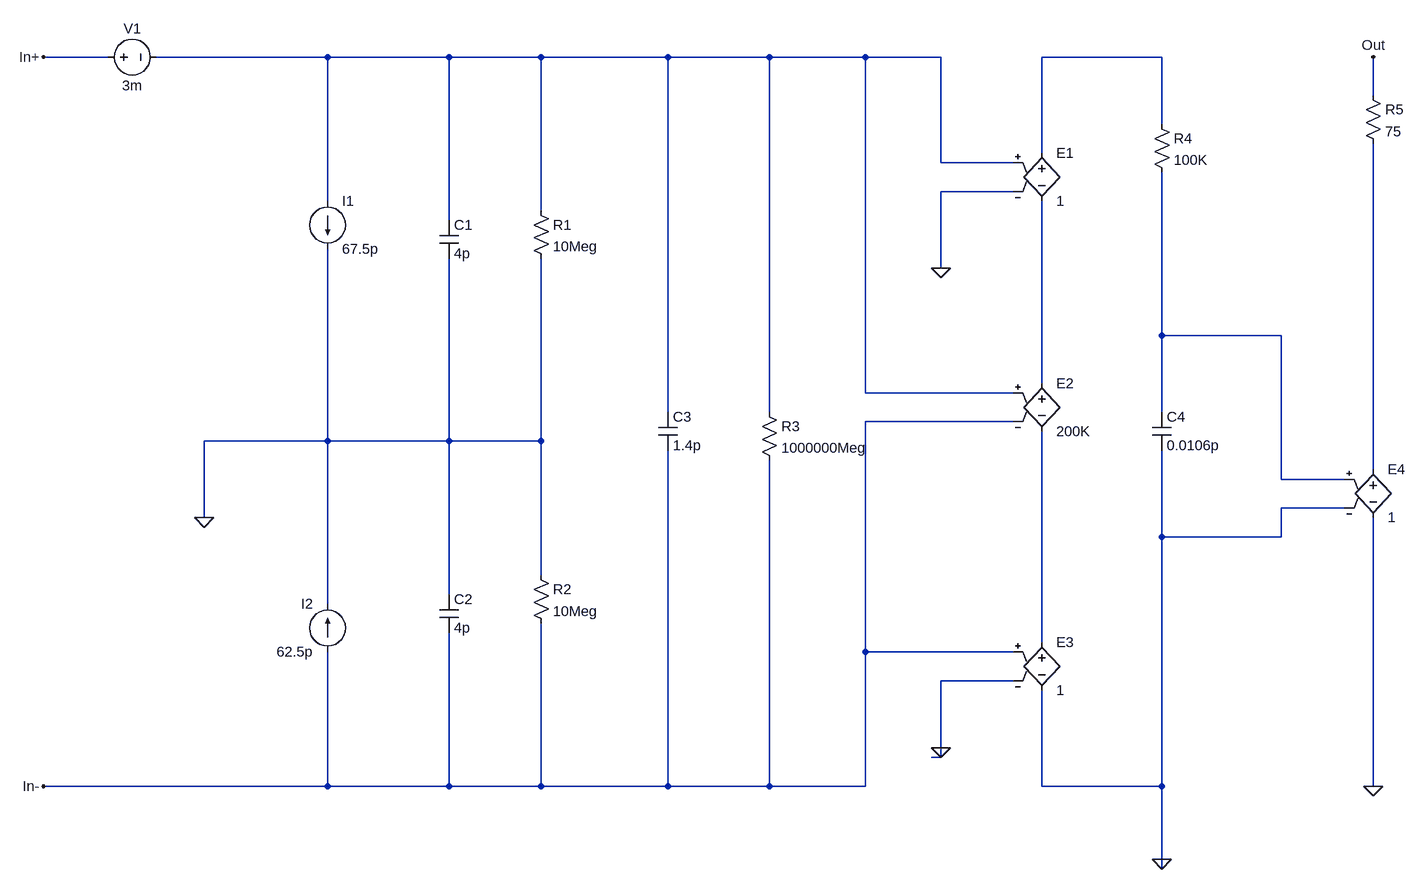
[diagram p0: schematic TL074_macromodel.asc]
TL074_macromodel.asc, the LTspice schematic file:
Version 4
SHEET 1 1640 1156
WIRE -1840 -272 -1968 -272
WIRE -1456 -272 -1760 -272
WIRE -1040 -272 -1456 -272
WIRE -640 -272 -1040 -272
WIRE -320 -272 -640 -272
WIRE -16 -272 -320 -272
WIRE 144 -272 -16 -272
WIRE 368 -272 144 -272
WIRE 960 -272 560 -272
WIRE 1584 -208 1584 -272
WIRE 960 -160 960 -272
WIRE 560 -112 560 -272
WIRE 368 -96 368 -272
WIRE 512 -96 368 -96
WIRE 512 -48 368 -48
WIRE -1456 -32 -1456 -272
WIRE -640 -16 -640 -272
WIRE -1040 0 -1040 -272
WIRE 368 80 368 -48
WIRE 368 80 352 80
WIRE 960 192 960 -80
WIRE 1424 192 960 192
WIRE 560 272 560 -32
WIRE 144 288 144 -272
WIRE 512 288 144 288
WIRE -320 320 -320 -272
WIRE -16 320 -16 -272
WIRE 960 320 960 192
WIRE 512 336 144 336
WIRE -1456 368 -1456 48
WIRE -1456 368 -1680 368
WIRE -1040 368 -1040 64
WIRE -1040 368 -1456 368
WIRE -640 368 -640 64
WIRE -640 368 -1040 368
WIRE 1584 416 1584 -128
WIRE 1424 432 1424 192
WIRE 1536 432 1424 432
WIRE 1536 480 1424 480
WIRE -1680 496 -1680 368
WIRE 960 528 960 384
WIRE 1424 528 1424 480
WIRE 1424 528 960 528
WIRE -640 592 -640 368
WIRE -1040 624 -1040 368
WIRE -1456 640 -1456 368
WIRE 560 704 560 352
WIRE 144 720 144 336
WIRE 512 720 144 720
WIRE 512 768 368 768
WIRE 368 880 368 768
WIRE 368 896 368 880
WIRE 368 896 352 896
WIRE -1456 944 -1456 720
WIRE -1456 944 -1968 944
WIRE -1040 944 -1040 688
WIRE -1040 944 -1456 944
WIRE -640 944 -640 672
WIRE -640 944 -1040 944
WIRE -320 944 -320 384
WIRE -320 944 -640 944
WIRE -16 944 -16 400
WIRE -16 944 -320 944
WIRE 144 944 144 720
WIRE 144 944 -16 944
WIRE 560 944 560 784
WIRE 960 944 960 528
WIRE 960 944 560 944
WIRE 1584 944 1584 496
WIRE 960 1136 960 944
WIRE 960 1152 960 1136
FLAG 960 1136 0
FLAG 1584 944 0
FLAG -1680 496 0
FLAG 368 80 0
FLAG 368 880 0
FLAG -1968 -272 In+
FLAG -1968 944 In-
FLAG 1584 -272 Out
SYMBOL /e 560 -128 R0
SYMATTR InstName E1
SYMATTR Value 1
SYMBOL /e 560 256 R0
SYMATTR InstName E2
SYMATTR Value 200K
SYMBOL /e 560 688 R0
SYMATTR InstName E3
SYMATTR Value 1
SYMBOL /e 1584 400 R0
SYMATTR InstName E4
SYMATTR Value 1
SYMBOL /current -1456 -32 R0
SYMATTR InstName I1
SYMATTR Value 67.5p
SYMBOL /current -1456 720 R180
WINDOW 0 24 80 Left 2
WINDOW 3 24 0 Left 2
SYMATTR InstName I2
SYMATTR Value 62.5p
SYMBOL /cap -1056 0 R0
SYMATTR InstName C1
SYMATTR Value 4p
SYMBOL /cap -1056 624 R0
SYMATTR InstName C2
SYMATTR Value 4p
SYMBOL /cap -336 320 R0
SYMATTR InstName C3
SYMATTR Value 1.4p
SYMBOL /cap 944 320 R0
SYMATTR InstName C4
SYMATTR Value 0.0106p
SYMBOL /res -656 -32 R0
SYMATTR InstName R1
SYMATTR Value 10Meg
SYMBOL /res -656 576 R0
SYMATTR InstName R2
SYMATTR Value 10Meg
SYMBOL /res -32 304 R0
SYMATTR InstName R3
SYMATTR Value 1000000Meg
SYMBOL /res 944 -176 R0
SYMATTR InstName R4
SYMATTR Value 100K
SYMBOL /res 1568 -224 R0
SYMATTR InstName R5
SYMATTR Value 75
SYMBOL voltage -1856 -272 R270
WINDOW 0 32 56 VTop 2
WINDOW 3 -32 56 VBottom 2
SYMATTR InstName V1
SYMATTR Value 3m

The netlist it stands for:
* TL074_macromodel.asc
E1 N002 N004 N001 0 1
E2 N004 N006 N001 In- 200K
E3 N006 0 In- 0 1
E4 N005 0 N003 0 1
I1 N001 0 67.5p
I2 In- 0 62.5p
C1 N001 0 4p
C2 0 In- 4p
C3 N001 In- 1.4p
C4 N003 0 0.0106p
R1 N001 0 10Meg
R2 0 In- 10Meg
R3 N001 In- 1000000Meg
R4 N002 N003 100K
R5 Out N005 75
V1 In+ N001 3m
.backanno
.end